# EAGLE design master_taylor (EAGLE 7.1.0)
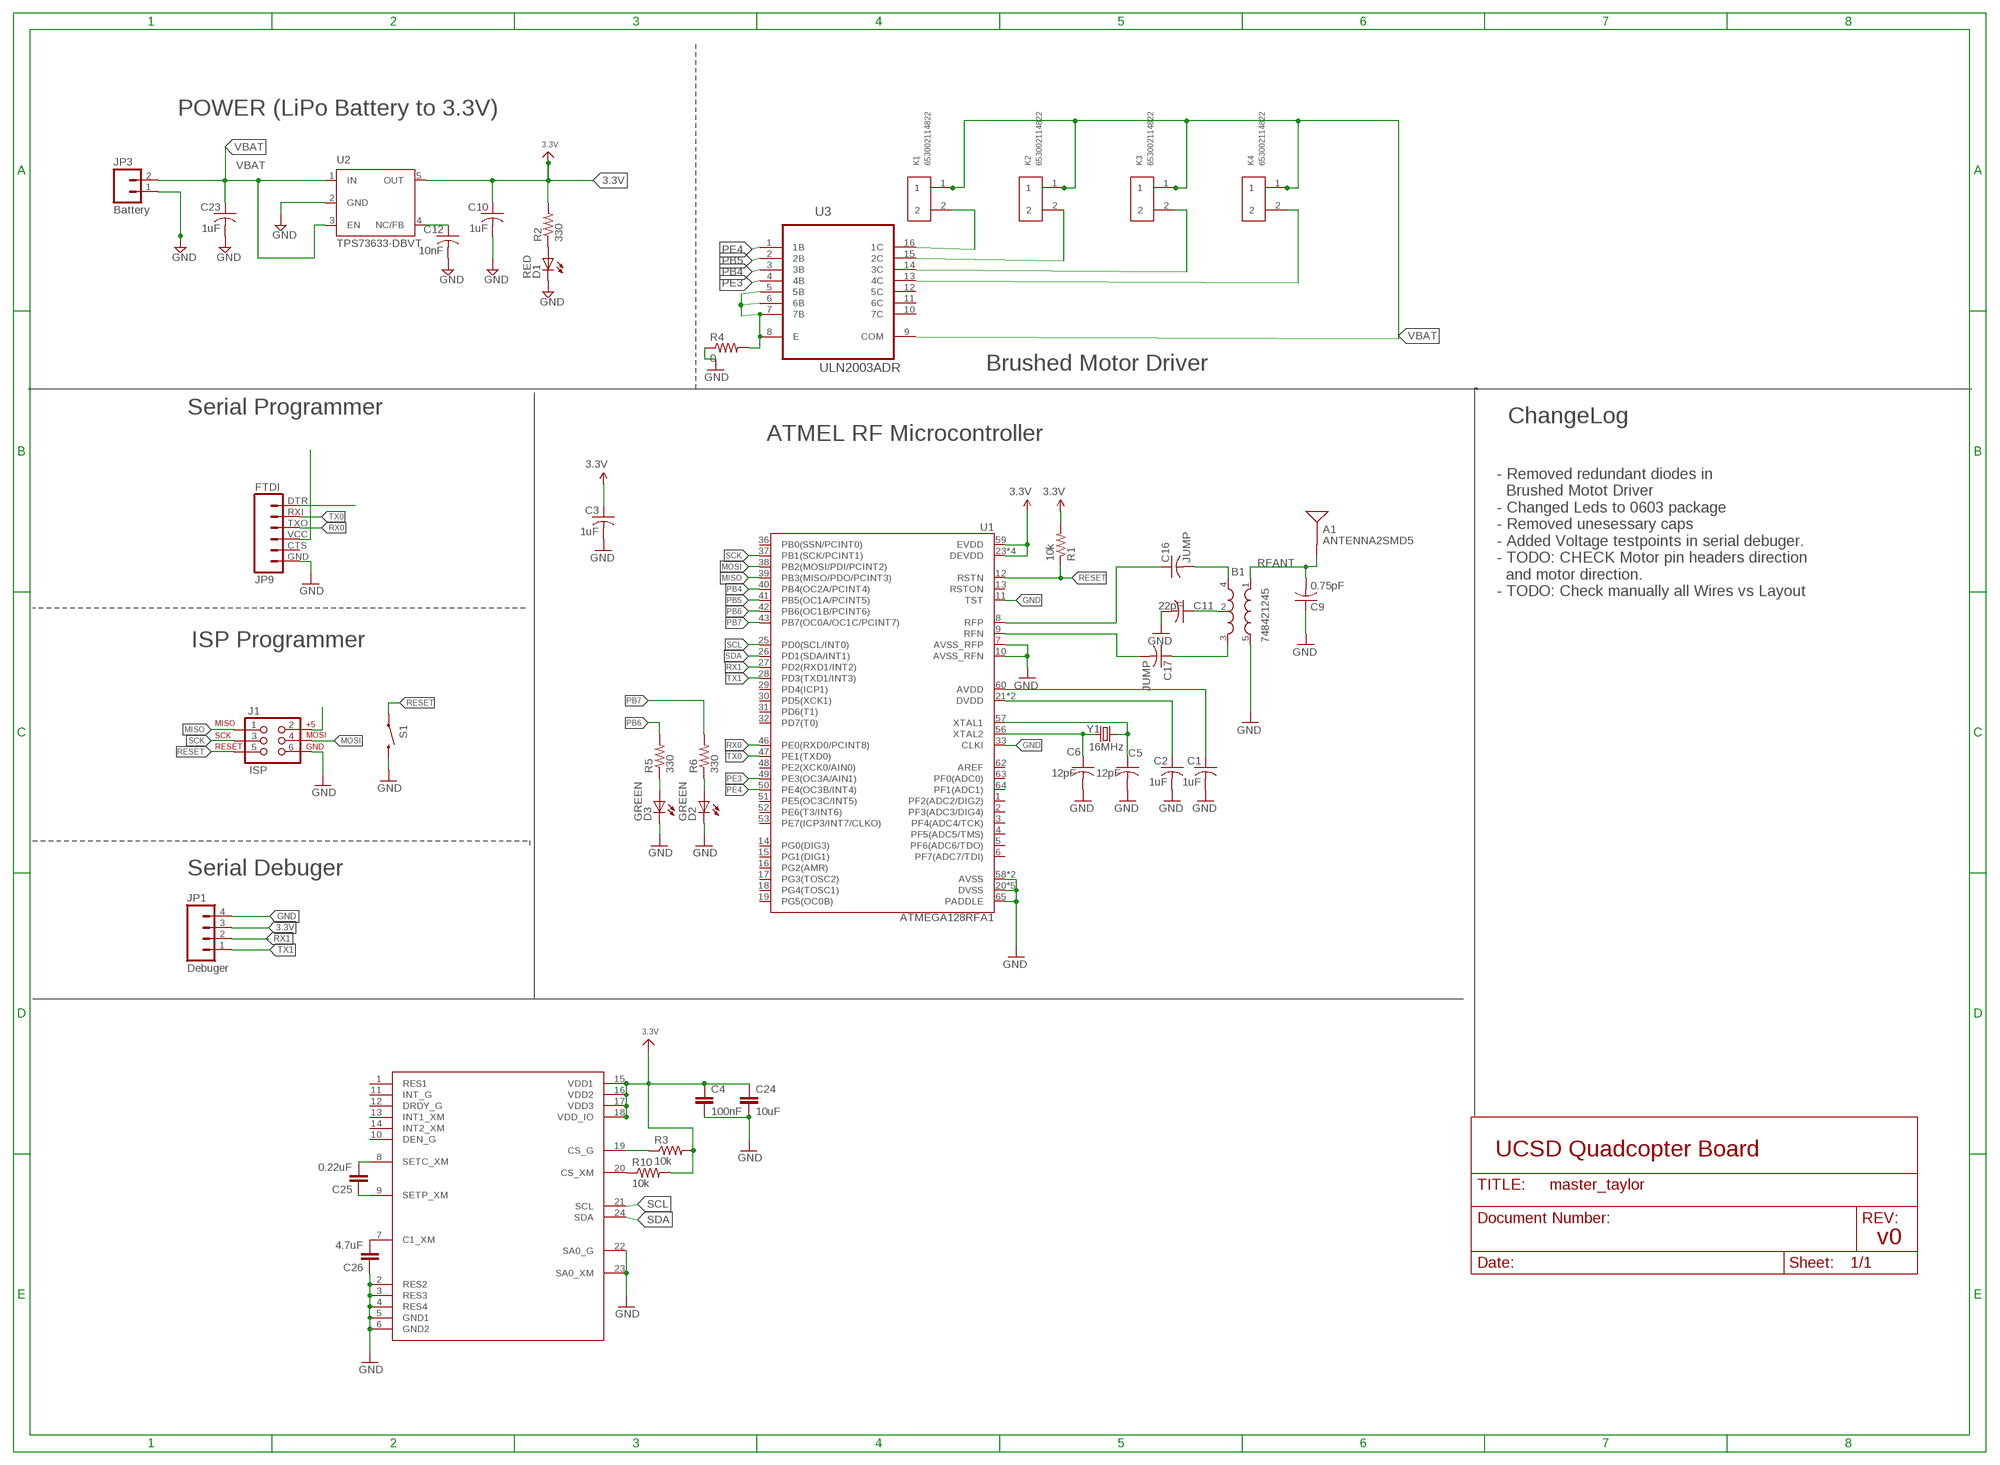
[diagram p0: schematic, sheet 1]

## Parts
A1  ANTENNA2SMD5  [ANTENNA-CHIP5]
B1  748421245  BALUN0805  [BALUN]
C1  1uF  C-USC0805  [C0805]
C2  1uF  C-USC0805  [C0805]
C3  1uF  C-USC0805  [C0805]
C4  100nF  CAP0805  [0805]
C5  12pF  C-USC0805  [C0805]
C6  12pF  C-USC0805  [C0805]
C9  0.75pF  C-USC0805  [C0805]
C10  1uF  C-USC0805  [C0805]
C11  22pF  C-USC0805  [C0805]
C12  10nF  C-USC0805  [C0805]
C16  JUMP  C-USC0805  [C0805]
C17  JUMP  C-USC0805  [C0805]
C23  1uF  C-USC0805  [C0805]
C24  10uF  CAP0805  [0805]
C25  0.22uF  CAP0805  [0805]
C26  4.7uF  CAP0805  [0805]
D1  RED  LEDCHIPLED_0603  [CHIPLED_0603]
D2  GREEN  LEDCHIPLED_0603  [CHIPLED_0603]
D3  GREEN  LEDCHIPLED_0603  [CHIPLED_0603]
J1  ISP  AVR_SPI_PRG_6NS  [2X3-NS]
JP1  Debuger  M04PTH  [1X04]
JP3  Battery  M02PTH  [1X02]
JP9  FTDI  FTDI_BASICPTH  [FTDI_BASIC]
K1  653002114822  [653002114822]
K2  653002114822  [653002114822]
K3  653002114822  [653002114822]
K4  653002114822  [653002114822]
R1  10k  R-US_R0805  [R0805]
R2  330  R-US_R0805  [R0805]
R3  10k  RESISTOR0805-RES  [0805]
R4  0  RESISTOR0805-RES  [0805]
R5  330  R-US_R0805  [R0805]
R6  330  R-US_R0805  [R0805]
R10  10k  RESISTOR0805-RES  [0805]
S1  SWITCH-MOMENTARY-2SMD  [TACTILE_SWITCH_SMD]
U1  ATMEGA128RFA1  [QFN-64]
U2  TPS73633-DBVT  [SOT23-DBV]
U3  ULN2003ADR  [SOIC127P600X175-16N]
U$1  LSM9DS0  [LGA-24]
Y1  16MHz  CRYSTAL5X3  [CRYSTAL-SMD-5X3]

## Nets
3.3V: C3.1 C4.1 C10.1 C24.1 JP1.3 R1.2 R2.2 R3.2 R10.2 U1.23(DEVDD) U1.34(DEVDD) U1.44(DEVDD) U1.54(DEVDD) U1.59(EVDD) U2.5(OUT) U$1.15(VDD1) U$1.16(VDD2) U$1.17(VDD3) U$1.18(VDD_IO)
AVDD: C1.1 U1.60(AVDD)
DTR: JP9.DTR
DVDD: C2.1 U1.21(DVDD) U1.22(DVDD)
GND: B1.5(GND) C1.2 C2.2 C3.2 C4.2 C5.2 C6.2 C9.1 C10.2 C11.2 C12.2 C23.2 C24.2 C26.1 D1.C D2.C D3.C J1.6 JP1.4 JP3.1 JP9.GND R4.1 S1.3 U1.7(AVSS_RFP) U1.10(AVSS_RFN) U1.11(TST) U1.20(DVSS) U1.24(DVSS) U1.33(CLKI) U1.35(DVSS) U1.45(DVSS) U1.55(DVSS) U1.58(AVSS) U1.61(AVSS) U1.65(PADDLE) U2.2(GND) U$1.2(RES2) U$1.3(RES3) U$1.4(RES4) U$1.5(GND1) U$1.6(GND2) U$1.22(SA0_G) U$1.23(SA0_XM)
MISO: J1.1 U1.39(PB3(MISO/PDO/PCINT3))
MOSI: J1.4 U1.38(PB2(MOSI/PDI/PCINT2))
N$1: C12.1 U2.4(NC/FB)
N$2: D1.A R2.1
N$3: C5.1 U1.57(XTAL1) Y1.3
N$4: C6.1 U1.56(XTAL2) Y1.1
N$7: B1.2(GND) C11.1
N$8: D3.A R5.1
N$9: JP9.VCC
N$10: B1.4(OUT1) C16.2
N$11: B1.3(OUT2) C17.1
N$12: R4.2 U3.5(5B) U3.6(6B) U3.7(7B) U3.8(E)
N$13: D2.A R6.1
N$14: J1.2
N$20: C26.2 U$1.7(C1_XM)
N$21: C25.2 U$1.8(SETC_XM)
N$22: C25.1 U$1.9(SETP_XM)
N$23: R3.1 U$1.19(CS_G)
N$24: R10.1 U$1.20(CS_XM)
N$29: K1.2 U3.16(1C)
N$30: K2.2 U3.15(2C)
N$31: K3.2 U3.14(3C)
N$32: K4.2 U3.13(4C)
PB4: U1.40(PB4(OC2A/PCINT4)) U3.3(3B)
PB5: U1.41(PB5(OC1A/PCINT5)) U3.2(2B)
PB6: R5.2 U1.42(PB6(OC1B/PCINT6))
PB7: R6.2 U1.43(PB7(OC0A/OC1C/PCINT7))
PE3: U1.49(PE3(OC3A/AIN1)) U3.4(4B)
PE4: U1.50(PE4(OC3B/INT4)) U3.1(1B)
RESET: J1.5 R1.1 S1.1 U1.12(RSTN)
RFANT [RFSIG]: A1.FEED(SIGNAL) B1.1(IN) C9.2
RFN: C17.2 U1.9(RFN)
RFP: C16.1 U1.8(RFP)
RX0: JP9.TXO U1.46(PE0(RXD0/PCINT8))
RX1: JP1.2 U1.27(PD2(RXD1/INT2))
SCK: J1.3 U1.37(PB1(SCK/PCINT1))
SCL: U1.25(PD0(SCL/INT0)) U$1.21(SCL)
SDA: U1.26(PD1(SDA/INT1)) U$1.24(SDA)
TX0: JP9.RXI U1.47(PE1(TXD0))
TX1: JP1.1 U1.28(PD3(TXD1/INT3))
VBAT: C23.1 JP3.2 K1.1 K2.1 K3.1 K4.1 U2.1(IN) U2.3(EN) U3.9(COM)
Unconnected: JP9.CTS U1.1(PF2(ADC2/DIG2)) U1.2(PF3(ADC3/DIG4)) U1.3(PF4(ADC4/TCK)) U1.4(PF5(ADC5/TMS)) U1.5(PF6(ADC6/TDO)) U1.6(PF7(ADC7/TDI)) U1.13(RSTON) U1.14(PG0(DIG3)) U1.15(PG1(DIG1)) U1.16(PG2(AMR)) U1.17(PG3(TOSC2)) U1.18(PG4(TOSC1)) U1.19(PG5(OC0B)) U1.29(PD4(ICP1)) U1.30(PD5(XCK1)) U1.31(PD6(T1)) U1.32(PD7(T0)) U1.36(PB0(SSN/PCINT0)) U1.48(PE2(XCK0/AIN0)) U1.51(PE5(OC3C/INT5)) U1.52(PE6(T3/INT6)) U1.53(PE7(ICP3/INT7/CLKO)) U1.62(AREF) U1.63(PF0(ADC0)) U1.64(PF1(ADC1)) U3.10(7C) U3.11(6C) U3.12(5C) U$1.1(RES1) U$1.10(DEN_G) U$1.11(INT_G) U$1.12(DRDY_G) U$1.13(INT1_XM) U$1.14(INT2_XM)

## Notes on the sheet
- POWER (LiPo Battery to 3.3V)
- Brushed Motor Driver
- Serial Programmer
- ChangeLog
- ATMEL RF Microcontroller
- - Removed redundant diodes in 
    Brushed Motot Driver
  - Changed Leds to 0603 package
  - Removed unesessary caps
  - Added Voltage testpoints in serial debuger.
  - TODO: CHECK Motor pin headers direction
    and motor direction.
  - TODO: Check manually all Wires vs Layout
- ISP Programmer
- Serial Debuger
- UCSD Quadcopter Board
- v0

## Library data of the parts
A1 = SparkFun-RF:ANTENNA2: Chip antenna Single endded antenna. Common with smaller chip antennas. CHIP4 package is the GPS Chip Antenna SKU: GPS-08418. CHIP5 package is 2.4GHz chip antenna SKU: WRL-00144.
B1 = SparkFun-RF:BALUN: 0805 footprint balun- Ember 351/357
C1-C3 C5 C6 C9-C12 C16 C17 C23 = resistor:C-US: CAPACITOR, American symbol
C4 C24-C26 = SparkFun-Capacitors:CAP: Capacitor Standard 0603 ceramic capacitor, and 0.1" leaded capacitor.
D1-D3 = led:LED: LED OSRAM: - CHIPLED LG R971, LG N971, LY N971, LG Q971, LY Q971, LO R971, LY R971 LH N974, LH R974 LS Q976, LO Q976, LY Q976 LO Q996 - Hyper CHIPLED LW Q18S LB Q993, LB Q99A, LB R99A - SideLED LS A670, LO A670, LY A670, LG A670, LP A670 LB A673, LV A673, LT A673, LW A673 LH A674 LY A675 LS A676, LA A676, LO A676, LY A676, LW A676 LS A679, LY A679, LG A679 - Hyper Micro SIDELED® LS Y876, LA Y876, LO Y876, LY Y876 LT Y87S - SmartLED LW L88C, LW L88S LB L89C, LB L89S, LG L890 LS L89K, LO L89K, LY L89K LS L896, LA L896, LO L896, LY L896 - TOPLED LS T670, LO T670, LY T670, LG T670, LP T670 LSG T670, LSP T670, LSY T670, LOP T670, LYG T670 LG T671, LOG T671, LSG T671 LB T673, LV T673, LT T673, LW T673 LH T674 LS T676, LA T676, LO T676, LY T676, LB T676, LH T676, LSB T676, LW T676 LB T67C, LV T67C, LT T67C, LS T67K, LO T67K, LY T67K, LW E67C LS E67B, LA E67B, LO E67B, LY E67B, LB E67C, LV E67C, LT E67C LW T67C LS T679, LY T679, LG T679 LS T770, LO T770, LY T770, LG T770, LP T770 LB T773, LV T773, LT T773, LW T773 LH T774 LS E675, LA E675, LY E675, LS T675 LS T776, LA T776, LO T776, LY T776, LB T776 LHGB T686 LT T68C, LB T68C - Hyper Mini TOPLED® LB M676 - Mini TOPLED Santana® LG M470 LS M47K, LO M47K, LY M47K Source: http://www.osram.convergy.de LUXEON: - LUMILED® LXK2-PW12-R00, LXK2-PW12-S00, LXK2-PW14-U00, LXK2-PW14-V00 LXK2-PM12-R00, LXK2-PM12-S00, LXK2-PM14-U00 LXK2-PE12-Q00, LXK2-PE12-R00, LXK2-PE12-S00, LXK2-PE14-T00, LXK2-PE14-U00 LXK2-PB12-K00, LXK2-PB12-L00, LXK2-PB12-M00, LXK2-PB14-N00, LXK2-PB14-P00, LXK2-PB14-Q00 LXK2-PR12-L00, LXK2-PR12-M00, LXK2-PR14-Q00, LXK2-PR14-R00 LXK2-PD12-Q00, LXK2-PD12-R00, LXK2-PD12-S00 LXK2-PH12-R00, LXK2-PH12-S00 LXK2-PL12-P00, LXK2-PL12-Q00, LXK2-PL12-R00 Source: www.luxeon.com KINGBRIGHT: KA-3528ASYC Source: www.kingbright.com
J1 = SparkFun-Connectors:AVR_SPI_PRG_6: AVR ISP 6 Pin This is the reduced ISP connector for AVR programming. Common on Arduino. This footprint will take up less PCB space and can be used with a 10-pin to 6-pin adapter such as SKU: BOB-08508
JP1 = SparkFun-Connectors:M04: Header 4 Standard 4-pin 0.1" header. Use with straight break away headers (SKU : PRT-00116), right angle break away headers (PRT-00553), swiss pins (PRT-00743), machine pins (PRT-00117), and female headers (PRT-00115). Molex polarized connector foot print use with SKU : PRT-08231 with associated crimp pins and housings. 1MM SMD Version SKU: PRT-10208
JP3 = SparkFun:M02: Header 2 Standard 2-pin 0.1" header. Use with straight break away headers (SKU : PRT-00116), right angle break away headers (PRT-00553), swiss pins (PRT-00743), machine pins (PRT-00117), and female headers (PRT-00115). Molex polarized connector foot print use with SKU : PRT-08233 with associated crimp pins and housings.
JP9 = SparkFun-Connectors:FTDI_BASIC: FTDI Basic header with labels
K1-K4 = Wuerth_Elektronik_eiCan_Wire_to_Board_Connectors:653002114822: WR-WTB 1.25mm Male Vertical Shrouded Header, 2 Pins=>Code : Con_WTB_1.25_PCB_THT_653002114822 <http://katalog.we-online.de/media/thumbs2/eican/thb_Con_WTB_1.25_PCB_THT_6530xx114822_pf2.jpg> Details see: http://katalog.we-online.de/en/em/653_0xx_114_822 Created 2014-06-06, Karrer Zheng 2014 (C) Würth Elektronik; OC_FARNELL: unknown
R1 R2 R5 R6 = resistor:R-US_: RESISTOR, American symbol
R3 R4 R10 = SparkFun-Passives:RESISTOR: Resistor Basic schematic elements and footprints for 0603, 1206, and PTH resistors.
S1 = SparkFun-Electromechanical:SWITCH-MOMENTARY-2: Various NO switches- pushbuttons, reed, etc
U1 = SparkFun-DigitalIC:ATMEGA128RFA1: ATmega128RFA1 8-bit AVR Microcontroller with Low Power 2.4GHz Transceiver for ZigBee and IEEE 802.15.4
U2 = Power:TPS73633-DBVT
U3 = Texas Instruments_By_element14_Batch_1:ULN2003ADR: 8-BIT SHIFT REGISTERS WITH 3-STATE OUTPUT REGISTERS; MPN: ULN2003ADR; OC_FARNELL: 1470513; OC_NEWARK: 77C3560; PACKAGE: SOIC-16; SUPPLIER: TEXAS INSTRUMENTS
U$1 = IMU_parts:LSM9DS0
Y1 = SparkFun-FreqCtrl:CRYSTAL: Various standard crystals. Proven footprints. Spark Fun Electronics SKU : COM-00534

## Net classes
1 RFSIG: width 0.457 mm, clearance 0.205 mm to class 0, clearance 0.205 mm

## Board
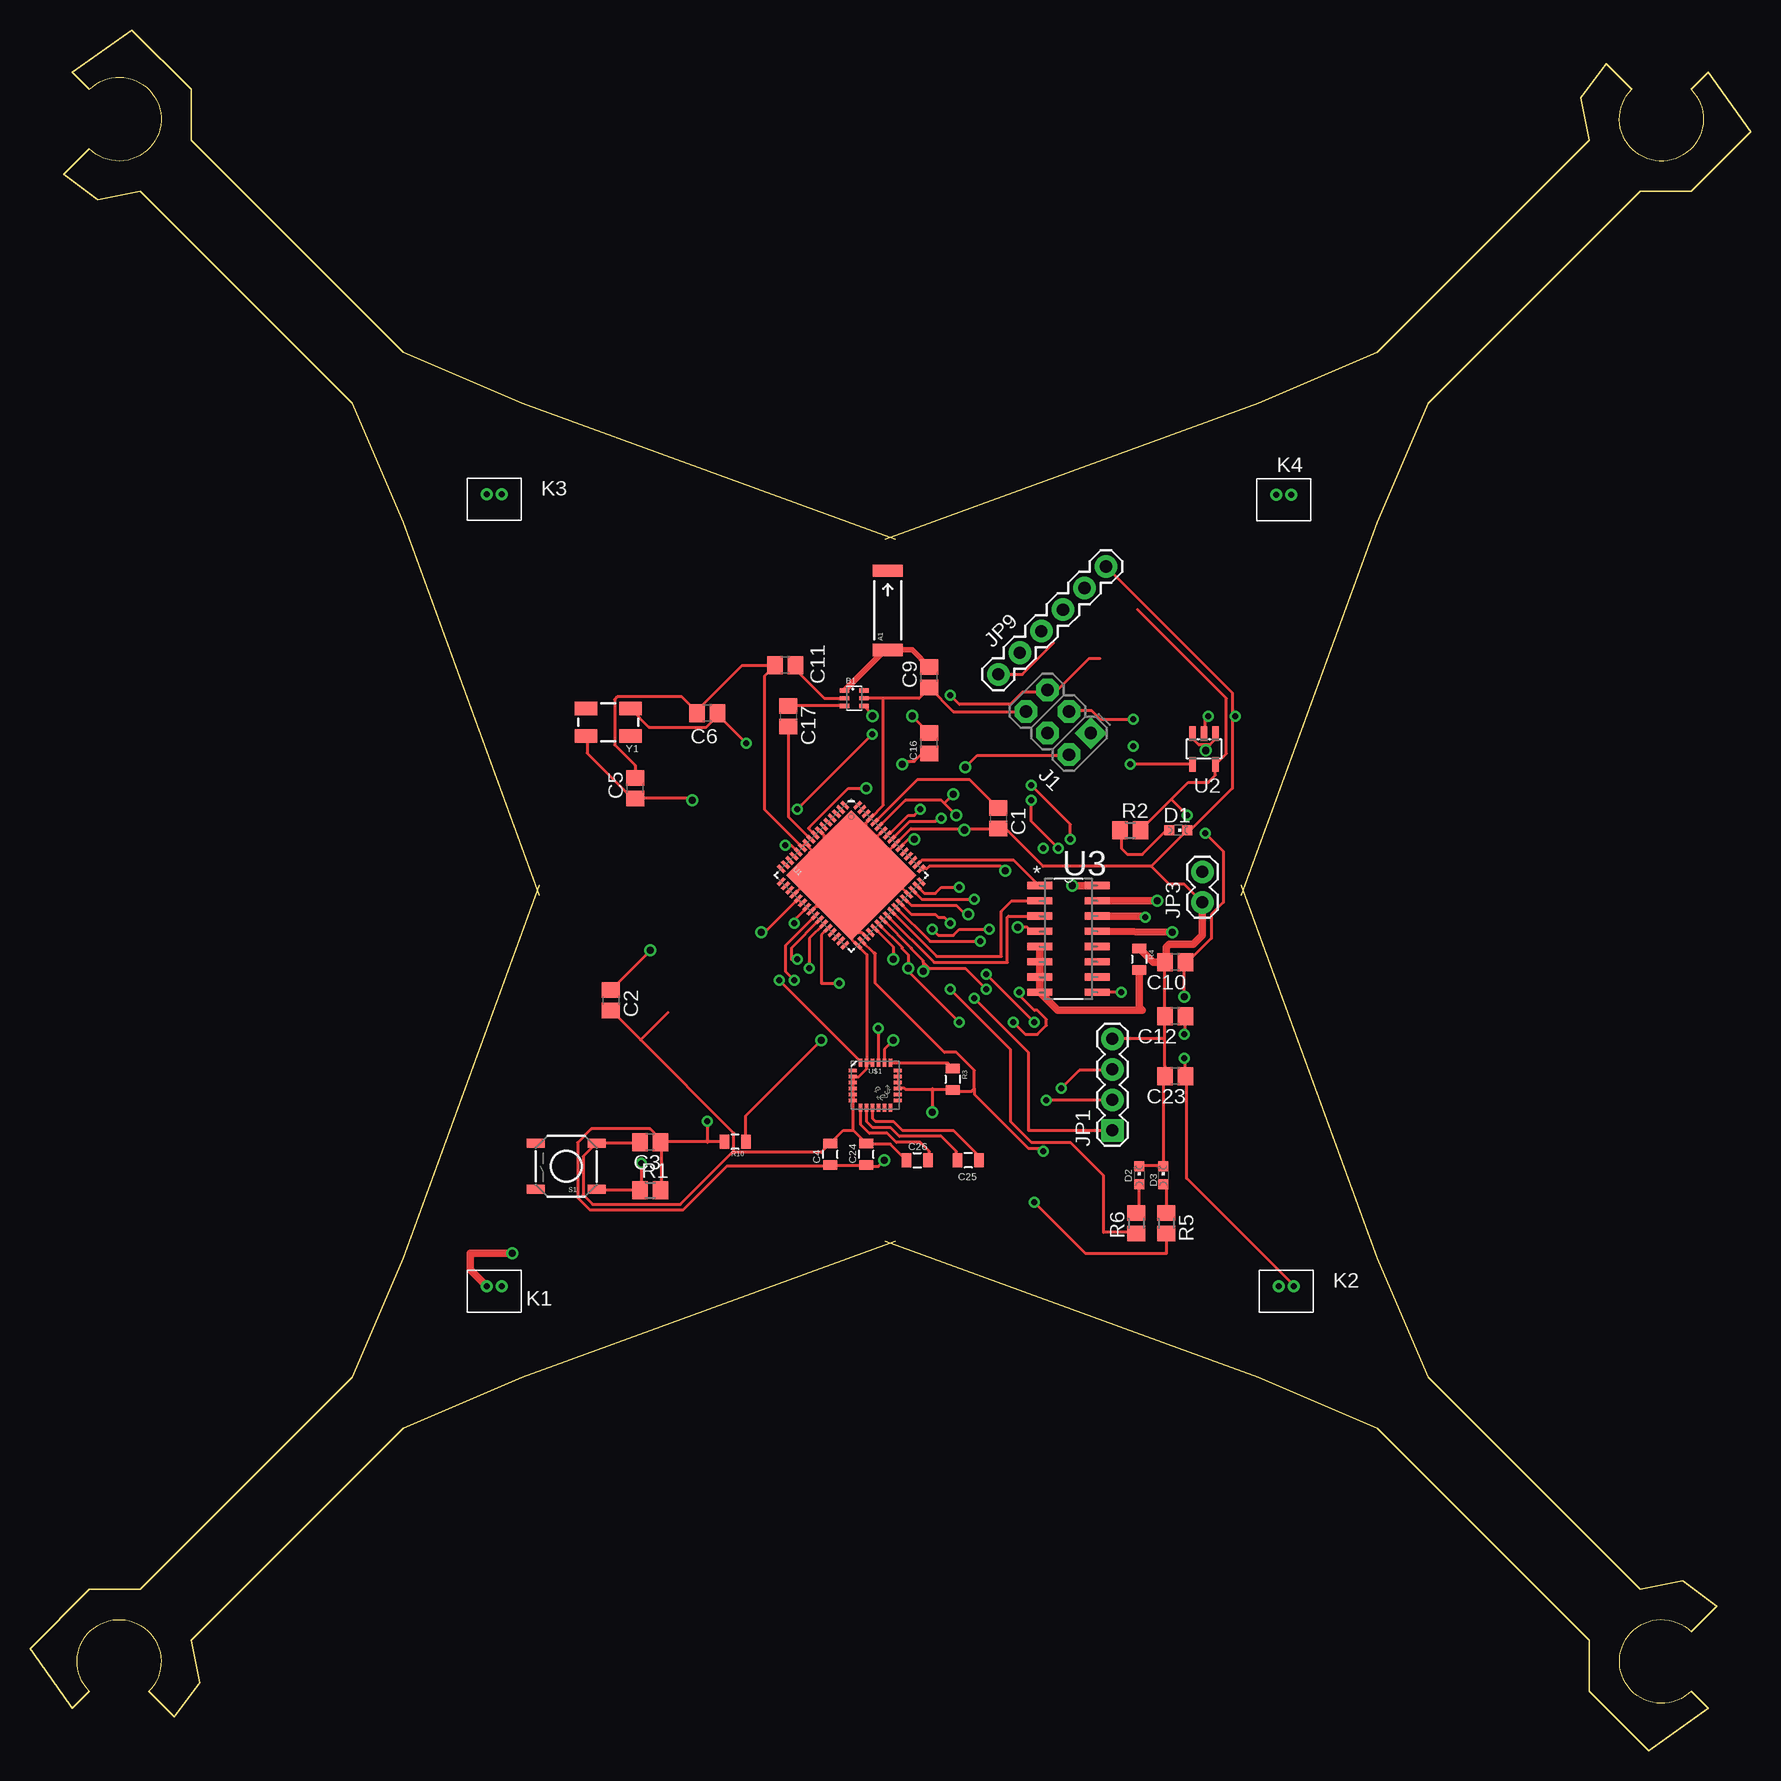
[diagram p1: board, top side]
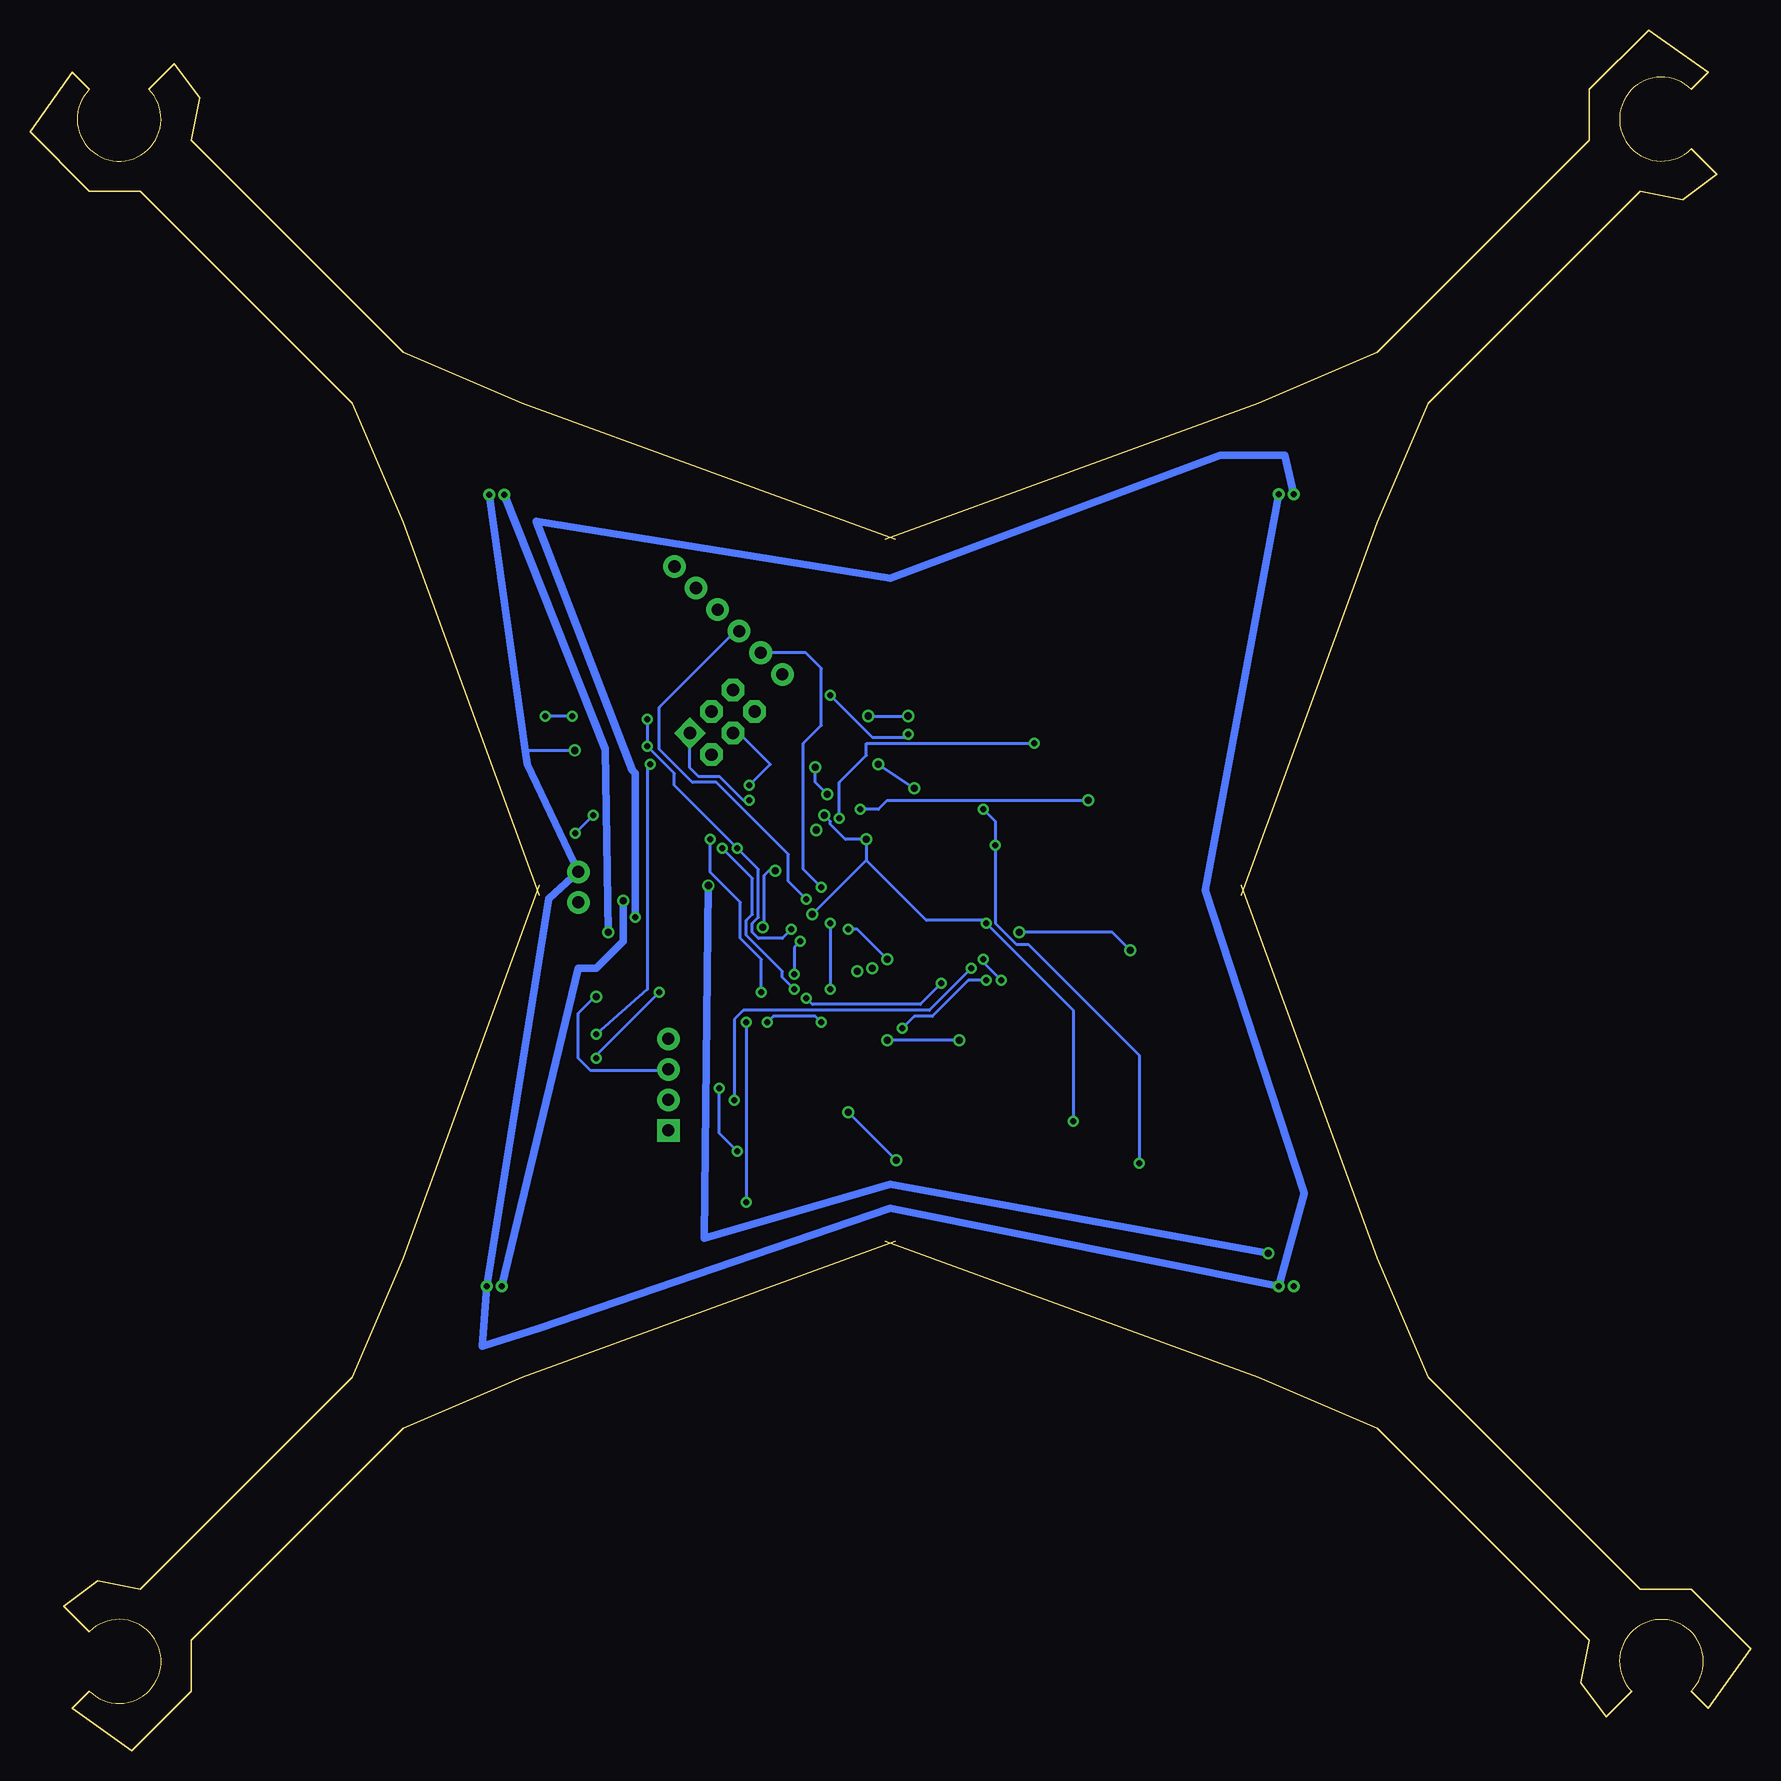
[diagram p2: board, bottom side, seen from below]

Size 143.38 x 143.38 mm. Coordinates in mm from the lower left corner, seen from the top.
Copper layers (1*16): Top 0.035559375mm / dielectric 1.501140625mm / Bottom 0.035559375mm
Design rules "4pcb-33board": minimum track width 10mil, minimum drill 15mil, track to track 6mil, track to pad 6mil, pad to pad 6mil, via to via 6mil, smd to smd 6mil, copper to edge 10mil, drill to drill 10mil, minimum pad ring 10mil, minimum via ring 8mil, stop-mask expansion 4mil, vias tented up to drill 0mil, thermal gap 10mil

### Footprints (pad centres in the part's own frame; a part is rotated, then mirrored left to right if it is on the bottom)
ANTENNA-CHIP5 = smd 1.016 x 2.54: FEED -3.302,0; NC 3.302,0
BALUN = smd 0.35 x 0.8: 1 -0.65,-0.8; 2 0,-0.8; 3 0.65,-0.8; 4 0.65,0.8; 5 0,0.8; 6 -0.65,0.8
C0805 = smd 1.3 x 1.5: 1 -0.85,0; 2 0.85,0
0805 = smd 0.8 x 1.2: 1 -0.9,0; 2 0.9,0
CHIPLED_0603 = smd 0.8 x 0.8: A 0,-0.75; C 0,0.75
2X3-NS = drill 1.016 pad 1.88 square: 1 -2.54,-1.27 | drill 1.016 pad 1.88 octagon: 2 -2.54,1.27; 3 0,-1.27; 4 0,1.27; 5 2.54,-1.27; 6 2.54,1.27
1X04 = drill 1.016 pad 1.88 square: 1 0,0 | drill 1.016 pad 1.88: 2 2.54,0; 3 5.08,0; 4 7.62,0
1X02 = drill 1.016 pad 1.88: 1 0,0; 2 2.54,0
FTDI_BASIC = drill 1.016 pad 1.88: CTS 10.16,0; DTR 0,0; GND 12.7,0; RXI 2.54,0; TXO 5.08,0; VCC 7.62,0
653002114822 = drill 0.5: 1 0.625,0; 2 -0.625,0
R0805 = smd 1.3 x 1.5: 1 -0.85,0; 2 0.85,0
TACTILE_SWITCH_SMD = smd 1.524 x 0.762: 1 -2.54,1.905; 2 2.54,1.905; 3 -2.54,-1.905; 4 2.54,-1.905
QFN-64 = smd 0.8 x 0.28: 1 -4.5,3.75; 2 -4.5,3.25; 3 -4.5,2.75; 4 -4.5,2.25; 5 -4.5,1.75; 6 -4.5,1.25; 7 -4.5,0.75; 8 -4.5,0.25; 9 -4.5,-0.25; 10 -4.5,-0.75; 11 -4.5,-1.25; 12 -4.5,-1.75; 13 -4.5,-2.25; 14 -4.5,-2.75; 15 -4.5,-3.25; 16 -4.5,-3.75; 33 4.5,-3.75; 34 4.5,-3.25; 35 4.5,-2.75; 36 4.5,-2.25; 37 4.5,-1.75; 38 4.5,-1.25; 39 4.5,-0.75; 40 4.5,-0.25; 41 4.5,0.25; 42 4.5,0.75; 43 4.5,1.25; 44 4.5,1.75; 45 4.5,2.25; 46 4.5,2.75; 47 4.5,3.25; 48 4.5,3.75 | smd 0.28 x 0.8: 17 -3.75,-4.5; 18 -3.25,-4.5; 19 -2.75,-4.5; 20 -2.25,-4.5; 21 -1.75,-4.5; 22 -1.25,-4.5; 23 -0.75,-4.5; 24 -0.25,-4.5; 25 0.25,-4.5; 26 0.75,-4.5; 27 1.25,-4.5; 28 1.75,-4.5; 29 2.25,-4.5; 30 2.75,-4.5; 31 3.25,-4.5; 32 3.75,-4.5; 49 3.75,4.5; 50 3.25,4.5; 51 2.75,4.5; 52 2.25,4.5; 53 1.75,4.5; 54 1.25,4.5; 55 0.75,4.5; 56 0.25,4.5; 57 -0.25,4.5; 58 -0.75,4.5; 59 -1.25,4.5; 60 -1.75,4.5; 61 -2.25,4.5; 62 -2.75,4.5; 63 -3.25,4.5; 64 -3.75,4.5 | smd 7.65 x 7.65: 65 0,0
SOT23-DBV = smd 0.55 x 1.2: 1 -0.95,-1.3; 2 0,-1.3; 3 0.95,-1.3; 4 0.95,1.3; 5 -0.95,1.3
SOIC127P600X175-16N = smd 2.057 x 0.61: 1 -4.801,8.89; 2 -4.801,7.62; 3 -4.801,6.35; 4 -4.801,5.08; 5 -4.801,3.81; 6 -4.801,2.54; 7 -4.801,1.27; 8 -4.801,0; 9 0,0; 10 0,1.27; 11 0,2.54; 12 0,3.81; 13 0,5.08; 14 0,6.35; 15 0,7.62; 16 0,8.89
LGA-24 = smd 0.7 x 0.29: 1 -1.875,1.25; 2 -1.875,0.75; 3 -1.875,0.25; 4 -1.875,-0.25; 5 -1.875,-0.75; 6 -1.875,-1.25; 13 1.875,-1.25; 14 1.875,-0.75; 15 1.875,-0.25; 16 1.875,0.25; 17 1.875,0.75; 18 1.875,1.25 | smd 0.29 x 0.7: 7 -1.25,-1.875; 8 -0.75,-1.875; 9 -0.25,-1.875; 10 0.25,-1.875; 11 0.75,-1.875; 12 1.25,-1.875; 19 1.25,1.875; 20 0.75,1.875; 21 0.25,1.875; 22 -0.25,1.875; 23 -0.75,1.875; 24 -1.25,1.875
CRYSTAL-SMD-5X3 = smd 1.9 x 1.1: 1 -1.85,-1.15; 2 1.85,-1.15; 3 1.85,1.15; 4 -1.85,1.15

### Placement (x,y rotation side)
A1  71.48,95.02 90 top
B1  68.69,87.69 270 top
C1  80.69,77.69 270 top
C2  48.41,62.52 270 top
C3  51.69,50.69 180 top
C4  66.69,49.69 90 top
C5  50.44,80.19 90 top
C6  56.44,86.44 180 top
C9  74.94,89.44 90 top
C10  95.44,65.69 180 top
C11  62.94,90.44 180 top
C12  95.44,61.19 180 top
C16  74.94,83.94 90 top
C17  63.19,86.19 270 top
C23  95.44,56.19 180 top
C24  69.69,49.69 90 top
C25  78.19,49.19 180 top
C26  73.94,49.19 0 top
D1  95.69,76.69 270 top
D2  92.44,47.94 0 top
D3  94.44,47.94 0 top
J1  85.69,85.69 135 top
JP1  90.19,51.69 90 top
JP3  97.69,70.69 90 top
JP9  80.69,89.69 45 top
K1  38.69,38.69 0 top
K2  104.69,38.69 0 top
K3  38.69,104.69 0 top
K4  104.48,104.65 0 top
R1  51.69,46.69 0 top
R2  91.69,76.69 0 top
R3  76.9,55.95 270 top
R4  92.44,65.94 270 top
R5  94.69,43.94 270 top
R6  92.19,43.94 270 top
R10  58.76,50.73 180 top
S1  44.69,48.69 180 top
U1  68.44,72.94 315 top
U2  97.83,83.47 180 top
U3  88.94,63.19 0 top
U$1  70.44,55.44 0 top
U$4  [QUAD_WING]  84.69,84.69 315 top
U$5  [QUAD_WING]  58.69,84.69 45 top
U$6  [QUAD_WING]  58.69,58.69 135 top
U$7  [QUAD_WING]  84.69,58.69 225 top
Y1  48.19,85.69 180 top

### Tracks (layer width: path | path; a pad name or v marks a point on that pad's centre or on a via)
3.3V  (via drill 0.5 pad 0.25, 0.6 pad 0.25, 0.61)
  Top 0.254: C3.1 52.49,50.77 52.49,51 51.69,51.8 46.77,51.8 45.63,50.66 45.63,46.09 46.66,45.06 54.43,45.06 58.09,48.72 66.66,48.72 C4.1 C24.1 69.69,48.69 70.69,48.69 v71.19,49.19 | 56.44,50.77 52.6,50.77 C3.1 | 56.44,50.77 57.86,50.77 R10.2 | R1.2 52.6,46.77 52.6,50.66 C3.1 | U$1.18 72.38,56.6 72.38,56.26 U$1.17 72.38,56.14 72.38,55.8 U$1.16 72.38,55.69 72.38,55.23 U$1.15 72.49,55.23 72.83,55.23 72.95,55.12 75.19,55.12 | 75.19,55.12 76.83,55.12 R3.2 76.94,54.94 78.44,54.94 78.69,55.19 | 69.4,67.35 U1.34 70.34,66.44 70.44,66.44 70.44,63.94 76.19,58.19 77.19,58.19 78.69,56.69 78.69,55.19 | 72.95,70.89 U1.44 72.94,70.94 73.44,70.44 77.19,70.44 78.19,69.44 v78.19,69.69 | v96.19,62.81 96.19,65.69 C10.1 96.44,65.69 98.44,67.69 98.44,69.69 99.44,70.69 99.44,74.94 v97.94,76.44 | 92.3,95.08 99.69,87.69 99.69,83.08 U2.5 98.78,81.28 98.19,80.69 96.54,80.69 95.11,79.26 | R2.2 95.11,79.26 | 95.11,79.26 v96.44,77.94 | 75.19,55.12 v75.19,53.19 | 75.19,55.19 75.19,55.12 | v73.69,75.94 73.44,76.19 72.69,75.44 U1.54 | U1.59 70.94,77.19 72.94,79.19 75.94,79.19 76.19,78.94 | v77.19,77.94 76.19,78.94 | v77.94,81.94 78.94,82.94 86.44,82.94 | 76.19,78.94 v76.94,79.69 | v56.44,52.44 56.44,50.77 | v63.69,68.94 63.69,69.19 64.69,70.19 U1.23 | 56.44,50.69 56.44,50.77 | v85.94,55.19 87.44,56.69 90.19,56.69 JP1.3 | v84.44,49.94 84.19,50.19 83.19,50.19 78.69,54.69 78.69,55.19
  Bottom 0.254: 90.19,56.81 | 90.19,56.81 90.31,56.69 | v96.19,62.81 96.31,62.81 97.69,61.44 97.69,57.69 96.69,56.69 90.19,56.69 JP1.3 90.21,56.83 90.19,56.81 | v96.44,77.94 v97.94,76.44 | v71.19,49.19 v75.19,53.19 | 73.69,74.19 v78.19,69.69 | 73.69,74.19 v73.69,75.94 75.44,75.94 76.69,77.19 76.69,77.44 v77.19,77.94 | v77.94,81.94 77.94,80.69 v76.94,79.69 | v56.44,52.44 56.44,61.69 v63.69,68.94 63.69,69.19 68.69,69.19 73.69,74.19 | v85.94,55.19 85.94,51.44 v84.44,49.94
AVDD
  Top 0.254: U1.60 73.96,80.94 78.29,80.94 C1.1
DTR
  Top 0.254: JP9.DTR 82.69,89.69 85.29,92.29
DVDD  (via drill 0.6 pad 0.25)
  Top 0.254: U1.22 64.26,70.66 64.03,70.89 U1.21 61.21,68.19 v60.94,68.19 | C2.1 51.69,66.65 v51.69,66.69
  Bottom 0.254: v51.69,66.69 53.19,68.19 v60.94,68.19
GND  (via drill 0.5 pad 0.25, 0.61)
  Top 0.254: C3.2 50.77,50.66 47.34,50.66 S1.3 47.11,50.54 46.09,49.52 46.09,46.31 46.89,45.51 54.2,45.51 58.53,49.85 | 50.89,59.23 58.66,51.46 58.66,49.97 58.53,49.85 | 50.89,59.23 48.49,61.63 C2.2 | 71.12,87.69 74.09,87.69 74.89,88.49 C9.1 76.94,86.59 J1.6 | 71.12,87.69 69.52,87.69 B1.5 | 71.58,75.12 71.69,75.12 72.15,75.58 U1.55 72.26,75.69 73.4,76.83 77.86,76.83 | 69.63,77.06 70.6,76.1 | 70.6,76.1 71.58,75.12 | 69.63,77.06 69.63,77.29 69.98,77.63 U1.61 70.09,77.75 71.12,78.78 71.12,87.69 | 77.86,76.83 80.6,76.83 C1.2 80.72,76.72 81.41,76.72 84.44,73.69 93.44,73.69 | U$1.23 69.75,57.29 70.09,57.29 U$1.22 | U$1.23 69.75,57.17 69.75,56.83 69.06,56.14 68.72,56.14 U$1.2 68.6,56.14 68.6,55.8 U$1.3 68.6,55.57 68.6,55.23 U$1.4 68.6,55.12 68.6,54.77 U$1.5 68.6,54.66 68.6,54.2 U$1.6 68.6,54.09 68.6,51.69 | C26.1 72.95,49.29 71.69,50.54 69.75,50.54 C24.2 69.63,50.66 68.6,51.69 | U1.65 68.49,72.83 68.49,67.57 68.95,67.12 U1.33 69.06,67 69.75,66.32 69.75,57.4 U$1.23 | 65.17,75 64.95,74.78 U1.65 | 65.17,75 66.2,76.03 66.2,76.26 65.86,76.6 U1.7 | 69.63,77.06 67.23,77.06 66.32,76.15 U1.65 | C5.2 50.43,81.06 50.43,82.09 48.72,83.81 48.72,87.58 48.94,87.81 54.32,87.81 55.57,86.55 C6.2 55.57,86.66 59.35,90.43 C11.2 61.19,89.54 61.19,78.44 64.37,75.26 U1.11 64.37,75.35 64.6,75.58 64.72,75.58 U1.10 64.72,75.46 65.17,75 | D2.C 92.49,48.72 94.44,48.72 D3.C 94.44,48.83 94.44,56.72 94.55,56.83 C23.2 94.55,57.06 94.55,59.31 | 94.55,59.31 94.55,61.17 C12.2 94.55,61.29 94.55,65.63 C10.2 | 65.17,75 U1.65 | 50.89,59.23 53.17,61.52 | U1.58 71.12,76.72 70.6,76.2 70.6,76.1 | v77.86,76.72 77.86,76.83
  Top 0.254: U1.45 72.62,71.94 72.44,71.94 71.44,72.94 71.44,74.69 71.58,74.83 71.58,75.12 | U1.35 69.31,68.19 68.56,68.19 U1.65 | 65.94,70.31 68.44,70.31 U1.65 | 65.94,70.31 65.44,70.31 65.06,69.94 U1.24 | 94.55,59.31 JP1.4 | U1.20 64.26,71.94 64.69,71.94 65.94,70.69 65.94,70.31 | 68.6,51.69 67.79,51.69 C4.2 65.95,49.85 58.53,49.85 | 93.44,73.69 D1.C 96.69,76.69 100.19,80.19 100.19,86.19 | JP9.GND 100.19,88.15 100.19,86.19 | JP3.1 96.19,72.19 94.94,72.19 93.44,73.69 | v100.44,86.19 100.19,86.19 | v98.19,86.19 97.94,85.94 97.94,84.94 U2.2
  Top 0.61: R4.1 93.59,65.69 C10.2 94.69,65.79 94.69,66.94 94.94,67.19 96.94,67.19 97.69,67.94 JP3.1
  Bottom 0.254: v98.19,86.19 v100.44,86.19
MISO  (via drill 0.5 pad 0.25, 0.6 pad 0.25)
  Top 0.254: U1.39 73.44,66.88 73.44,66.81 74.44,65.81 74.44,65.69 | 74.44,65.69 v74.44,64.94 | v83.44,79.19 83.44,77.44 v85.69,75.19 | v79.69,63.44 77.94,65.19 74.94,65.19 74.44,65.69
  Bottom 0.254: J1.1 88.44,84.74 88.44,81.94 87.69,81.19 85.94,81.19 83.94,79.19 v83.44,79.19 | v85.69,75.19 83.19,72.69 83.19,69.69 83.69,69.19 83.69,67.94 80.69,64.94 80.69,64.44 v79.69,63.44
MOSI  (via drill 0.5 pad 0.25, 0.6 pad 0.25)
  Top 0.254: U1.38 72.69,66.92 72.69,66.81 73.19,66.31 v73.19,65.19 73.19,64.94 v77.44,60.69 | v83.44,80.44 86.69,77.19 v86.69,75.94 | v82.44,63.19 82.44,62.94 83.69,61.69 83.94,61.69 84.69,60.94 84.69,60.44 83.94,59.69 82.94,59.69 v81.94,60.69
  Bottom 0.254: v83.44,80.44 81.69,82.19 84.29,84.79 J1.4 | v86.69,75.94 86.69,73.19 84.19,70.69 84.19,67.69 82.44,65.94 v82.44,63.19 | v81.94,60.69 81.44,61.19 77.94,61.19 v77.44,60.69
N$1  (via drill 0.5 pad 0.25)
  Top 0.254: U2.4 96.86,82.19 v91.69,82.19 | v96.19,59.69 96.29,59.79 C12.1
  Bottom 0.254: v91.69,82.19 91.94,81.94 91.94,63.44 v96.19,59.69
N$2
  Top 0.254: 94.94,76.44 D1.A 94.69,76.69 92.69,74.69 91.44,74.69 90.94,75.19 90.94,76.69 R2.1
N$3  (via drill 0.5 pad 0.25, 0.6 pad 0.25)
  Top 0.254: Y1.3 46.43,84.49 46.43,83.12 50.2,79.35 C5.1 55.04,79.34 v55.19,79.19 | v74.19,78.44 73.69,77.94 73.19,77.94 71.69,76.44 U1.57
  Bottom 0.254: v55.19,79.19 71.94,79.19 72.69,78.44 v74.19,78.44
N$4  (via drill 0.5 pad 0.25)
  Top 0.254: Y1.1 50.09,86.78 51.57,85.29 56.37,85.29 57.29,86.21 C6.1 57.29,86.34 v59.69,83.94 | U1.56 73.29,77.44 75.44,77.44 75.69,77.69 v75.94,77.69
  Bottom 0.254: v59.69,83.94 73.69,83.94 73.69,82.94 75.94,80.69 v75.94,77.69
N$7
  Top 0.254: C11.1 63.79,90.09 66.19,87.69 B1.2
N$8
  Top 0.254: 94.44,47.11 D3.A 94.69,47.19 R5.1 94.44,44.83
N$10  (via drill 0.61)
  Top 0.254: v70.2,86.21 70.2,86.32 69.52,87.01 B1.4 | v73.52,86.21 74.89,84.83 C16.2
  Bottom 0.254: v73.52,86.21 v70.2,86.21
N$11
  Top 0.254: B1.3 67.8,87.12 63.23,87.12 C17.1
N$12
  Top 0.61: U3.5 U3.6 U3.7 U3.8 85.64,61.69 92.69,61.69 92.44,61.94 R4.2
N$13
  Top 0.254: 92.49,47.11 D2.A 92.44,44.94 R6.1 92.49,44.83
N$20
  Top 0.254: U$1.7 69.19,52.19 69.94,51.44 71.44,51.44 72.19,50.69 74.19,50.69 74.94,49.94 74.94,49.19 C26.2
N$21
  Top 0.254: U$1.8 69.69,52.44 70.19,51.94 71.69,51.94 72.44,51.19 75.94,51.19 77.19,49.94 77.19,49.19 C25.2
N$22
  Top 0.254: U$1.9 70.19,52.69 70.44,52.44 71.94,52.44 72.69,51.69 76.94,51.69 79.19,49.44 79.19,49.19 C25.1
N$23
  Top 0.254: U$1.19 71.69,57.29 76.49,57.29 76.83,56.94 R3.1
N$24  (via drill 0.6 pad 0.25)
  Top 0.254: R10.1 59.66,52.91 v65.94,59.19 | v71.94,59.19 71.19,58.44 U$1.20
  Bottom 0.254: v65.94,59.19 v71.94,59.19
N$29  (via drill 0.6 pad 0.25)
  Top 0.61: K1.2 36.69,40.06 36.69,41.44 v40.19,41.44 | v86.84,72.08 U3.16
  Bottom 0.61: v40.19,41.44 71.69,47.19 87.19,42.69 v86.84,72.08
N$30  (via drill 0.6 pad 0.25)
  Top 0.61: v93.95,70.81 U3.15
  Bottom 0.61: K2.2 97.69,65.19 96.19,65.19 93.94,67.44 v93.94,70.8 v93.95,70.81
N$31  (via drill 0.5 pad 0.25)
  Top 0.61: U3.14 92.84,69.54 v92.94,69.44
  Bottom 0.61: K3.2 38.81,107.94 44.19,107.94 71.69,97.69 101.19,102.44 93.19,81.69 92.94,81.44 v92.94,69.44
N$32  (via drill 0.6 pad 0.25)
  Top 0.61: v95.19,68.19 U3.13
  Bottom 0.61: K4.2 95.44,83.44 v95.19,68.19
PB4
  Top 0.254: U1.40 75.34,65.69 81.44,65.69 81.44,69.44 81.54,69.54 U3.3
PB5
  Top 0.254: U1.41 75.54,66.19 80.94,66.19 80.94,69.94 81.81,70.81 U3.2
PB6  (via drill 0.5 pad 0.25)
  Top 0.254: U1.42 75,67.44 v79.19,67.44 | v79.69,64.69 v83.69,60.69 | v83.69,45.69 87.94,41.44 94.69,41.44 R5.2
  Bottom 0.254: v79.69,64.69 79.69,66.94 v79.19,67.44 | v83.69,60.69 v83.69,45.69
PB7  (via drill 0.5 pad 0.25)
  Top 0.254: v76.69,63.44 81.69,58.44 81.69,52.44 83.44,50.69 86.69,50.69 89.44,47.94 89.44,43.19 92.19,43.19 R6.2 | U1.43 72.69,70.44 73.44,69.69 75.44,69.69 75.69,69.44 76.19,69.44 v76.69,68.94
  Bottom 0.254: v76.69,68.94 v76.69,63.44
PE3  (via drill 0.61)
  Top 0.254: 83.46,68.37 84.03,68.37 U3.4 83.35,68.37 83.12,68.6 v82.32,68.6 | 74.43,73.4 74.32,73.4 U1.49 74.72,73.47 74.94,73.69 80.9,73.69 v81.28,73.31
  Bottom 0.254: v82.32,68.6 82.19,68.73 82.19,72.94 81.82,73.31 v81.28,73.31
PE4
  Top 0.254: U1.50 73.98,73.86 74.32,74.2 81.98,74.2 84.03,72.15 U3.1
RESET  (via drill 0.5 pad 0.25)
  Top 0.254: 89.18,91.01 88.26,91.01 85.75,88.49 84.83,88.49 J1.5 84.69,88.19 82.69,88.19 81.69,87.19 77.44,87.19 v76.69,87.94 | S1.1 47.44,46.69 R1.1 50.94,46.69 v50.94,48.94 | v62.94,75.44 63.44,75.44 63.94,74.94 U1.12 | v70.19,84.69 v63.94,78.44
  Bottom 0.254: v63.94,78.44 62.94,77.44 v62.94,75.44 62.94,68.94 61.19,67.19 60.19,67.19 50.94,57.94 v50.94,48.94 | v70.19,84.69 70.44,84.44 73.19,84.44 v76.69,87.94
RFANT
  Top 0.457: C9.2 73.51,91.72 A1.FEED 71.27,91.72 B1.1
RFN
  Top 0.254: C17.2 63.19,77.81 65.06,75.94 U1.9
RFP  (via drill 0.6 pad 0.25)
  Top 0.254: U1.8 64.87,76.87 64.94,76.94 68.19,80.19 v69.69,80.19 | v72.69,82.19 72.94,82.44 73.69,82.44 74.44,83.19 74.94,83.19 C16.1
  Bottom 0.254: v69.69,80.19 v72.69,82.19
RX0  (via drill 0.5 pad 0.25)
  Top 0.254: U1.46 74.33,70.94 v78.69,70.94
  Bottom 0.254: v78.69,70.94 80.19,72.44 80.19,74.69 86.19,80.69 88.19,80.69 90.94,83.44 90.94,86.94 84.6,93.28 JP9.TXO
RX1  (via drill 0.5 pad 0.25)
  Top 0.254: U1.27 64.94,67.67 v64.94,65.19 | v84.69,54.19 84.73,54.23 JP1.2
  Bottom 0.254: v64.94,65.19 68.44,61.69 83.94,61.69 84.69,60.94 v84.69,54.19
SCK  (via drill 0.5 pad 0.25, 0.6 pad 0.25)
  Top 0.254: U1.37 71.94,66.96 v71.94,65.94 | v79.94,68.44 77.44,68.44 76.94,67.94 75.69,67.94 v75.19,68.44 | v91.94,85.94 89.19,85.94 88.44,86.69 86.69,86.69 J1.3
  Bottom 0.254: v79.94,68.44 80.69,67.69 82.69,67.69 83.19,68.19 83.19,68.94 82.69,69.44 82.69,73.44 v84.44,75.19 89.69,80.44 89.69,81.44 v91.94,83.69 v91.94,85.94 | v75.19,68.44 74.44,68.44 v71.94,65.94
SCL  (via drill 0.5 pad 0.25)
  Top 0.254: U1.25 62.94,67.09 62.94,64.94 v63.69,64.19 | v70.69,60.19 U$1.21
  Bottom 0.254: v70.69,60.19 69.69,61.19 68.19,61.19 65.19,64.19 v63.69,64.19
SDA  (via drill 0.5 pad 0.25)
  Top 0.254: U1.26 63.44,66.88 63.44,65.94 v63.94,65.94 | v62.44,64.19 69.19,57.44 U$1.24
  Bottom 0.254: v62.44,64.19 63.94,65.69 v63.94,65.94
TX0  (via drill 0.5 pad 0.25)
  Top 0.254: U1.47 74.54,71.44 75.44,71.44 75.94,71.94 v77.44,71.94
  Bottom 0.254: v77.44,71.94 78.94,73.44 78.94,83.94 77.44,85.44 77.44,90.19 78.74,91.49 JP9.RXI
TX1  (via drill 0.5 pad 0.25)
  Top 0.254: U1.28 65.94,67.96 65.94,63.94 v67.44,63.94 | v78.69,62.69 83.19,58.19 83.19,51.69 JP1.1
  Bottom 0.254: v78.69,62.69 78.19,62.19 69.19,62.19 v67.44,63.94
VBAT  (via drill 0.5 pad 0.25, 0.61)
  Top 0.254: 97.98,83.81 98.32,83.81 98.78,84.26 98.78,84.72 U2.1 | 97.98,83.81 97.41,83.81 96.95,84.26 96.95,84.72 U2.3 | K2.1 105.29,38.77 96.38,47.69 96.38,56.83 C23.1 96.29,57.59 v96.19,57.69 | v97.98,83.35 97.98,83.81 | v90.94,63.19 U3.9
  Bottom 0.254: v97.98,83.35 101.86,83.35 102.1,83.32 | v96.19,57.69 96.19,57.94 v90.94,63.19
  Bottom 0.61: K3.1 45.44,71.69 37.19,46.44 K1.1 71.69,45.19 100.94,35.19 105.69,33.69 K2.1 100.15,71 JP3.2 101.94,82.19 102.1,83.32 K4.1